# Altium project FFS - AT25EU.PrjPcb
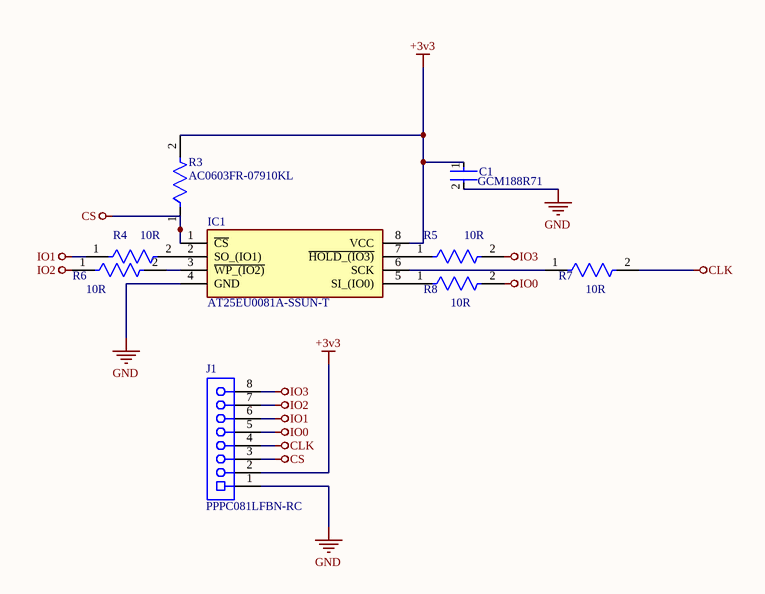
[diagram p0: AT25EU - 16 MBit SPI.SchDoc]
1 sheet, 9 parts. Net scope: global (net labels, ports and power ports of the same name join across sheets).
Board file: AT25EU - Chipset 16MBit SPI.PcbDoc

## Sheet AT25EU - 16 MBit SPI.SchDoc
size A4; SheetNumber: 1; SheetTotal: 1

### Parts
C1  GCM188R71  [FP-GCM188-0_1-IPC_B]
IC1  AT25EU0081A-SSUN-T  [SOIC127P600X175-8N]
J1  PPPC081LFBN-RC  [SLIN-PPPC081LFBN-RC_V]
R3  AC0603FR-07910KL  [FP-AC0603-IPC_B]
R4  10R  [FP-AC0603-MFG]
R5  10R  [FP-AC0603-MFG]
R6  10R  [FP-AC0603-MFG]
R7  10R  [FP-AC0603-MFG]
R8  10R  [FP-AC0603-MFG]

### Nets
+3v3: C1.1 IC1.8(VCC) J1.2 R3.2
CLK: J1.4 R7.2
CS: IC1.1(~{CS}) J1.3 R3.1
GND: C1.2 IC1.4(GND) J1.1
IO0: J1.5 R8.2
IO1: J1.6 R4.1
IO2: J1.7 R6.1
IO3: J1.8 R5.2
NetIC1_2: IC1.2(SO_(IO1)) R4.2
NetIC1_3: IC1.3(~{WP_(IO2)}) R6.2
NetIC1_5: IC1.5(SI_(IO0)) R8.1
NetIC1_6: IC1.6(SCK) R7.1
NetIC1_7: IC1.7(~{HOLD_(IO3)}) R5.1

### Library data of the parts
C1 = CMP-2006-02357-2: Ceramic Capacitor for Automotive 1uF  ±10% 16VDC X7R 0603 Paper T/R; Voltage: 16V; Thickness: 0.035inch; Width: 0.031inch; Radiation Hardening: No; Depth: 0.8mm; Max Operating Temperature: 125°C; Package Quantity: 1; Ratings: AEC-Q200; Min Operating Temperature: -55°C; Packaging: Tape and Reel; Case Code (Metric): 1608; REACH SVHC: No SVHC; Dielectric: X7R; Case Code (Imperial): 0603; Length: 1.6mm; Height: 0.8mm; Voltage Rating: 16V; Termination: SMD/SMT; Case/Package: 0603; Voltage Rating (DC): 16V; Tolerance: 10%; Capacitance: 1uF; Mount: Surface Mount; Lead Free: Lead Free
IC1 = AT25EU0081A-SSUN-T: Integrated Circuit; Manufacturer_Name: Renesas Electronics; Datasheet Link: https://www.renesas.com/us/en/document/dst/at25eu0081a-datasheet; Height: 1.75mm; Manufacturer_Part_Number: AT25EU0081A-SSUN-T
J1 = CMP-002-00028-2: Female Header, Pitch 2.54 mm, 1 x 8 Position, Height 8.5 mm, Tail Length 3.2 mm, -40 to 105 degC, RoHS, Bulk; Manufacturer: Sullins; Package Reference: PPPC081LFBN-RC; Connector Type: Header; Datasheet Version: Jan-15; Package Description: Female Header, Pitch 2.54 mm, 1 x 8 Position, Height 8.5 mm, Tail Length 3.2 mm; RoHS Compliant: Unknown; Max Operating Temperature: 105°C; Case/Package: PPPC081LFBN-RC; Min Operating Temperature: -40°C; Datasheet URL: http://sullinscorp.com/catalogs/101_PAGE114-115_.100_FEMALE_HDR.pdf; Gender: Female; Mounting Technology: TH
R3 = CMP-03412-028406-2: RES 910KΩ 1.00% 0.1W 0603; Voltage Rating: 50V; Power Rating: 100mW; Tolerance: 1%; Temperature Coefficient: 100ppm/°C; Resistance: 910kR; Max Operating Temperature: 155°C; Resistor Type: Thick Film; Case Code (Metric): 1608; Number of Terminations: 2; Case/Package: 0603; Packaging: Tape and Reel; Length: 0.063inch; Width: 0.8mm; Case Code (Imperial): 0603; Series: AC; RoHS Compliant: Yes; Termination: SMD/SMT; Min Operating Temperature: -55°C; Max Power Dissipation: 100mW; Features: Moisture Resistant; Height: 0.022inch
R4-R8 = CMP-2000-04819-3: RES 10Ω 1.00% 0.1W 0603; Tolerance: 1%; Voltage Rating: 50V; Power Rating: 100mW; Working Voltage: 75V; Temperature Coefficient: 200ppm/°C; Case/Package: 0603; Length: 0.063inch; Technology: THICK FILM; Features: Moisture Resistant; Moisture Sensitivity Level: 1; RoHS Compliant: Yes; Number of Terminations: 2; Min Operating Temperature: -55°C; Series: AC; Package Quantity: 1; Height: 0.022inch; Case Code (Metric): 1608; Termination: SMD/SMT; Packaging: Tape and Reel; Max Operating Temperature: 155°C; Width: 0.031inch; Resistor Type: Thick Film; Max Power Dissipation: 100mW; Resistance: 10R; Case Code (Imperial): 0603; Lead Free: Lead Free